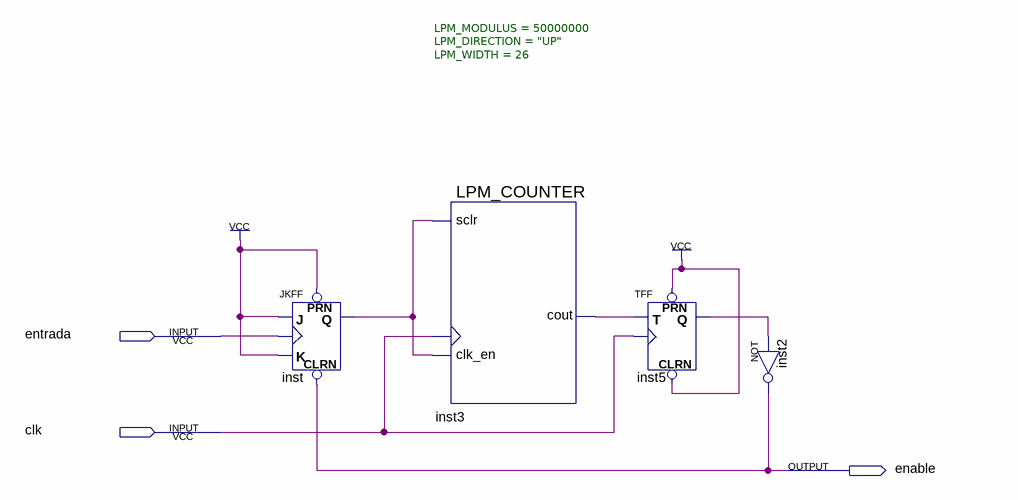
[diagram p0: schematic sheet]
// Quartus schematic pulse_to_buzzer.bdf as structural Verilog: 4 symbols, 3 pins
module pulse_to_buzzer (
  input  entrada,
  input  clk,
  output enable
);

  wire inst3_cout, inst5_q, inst_q;

  JKFF inst (.PRN(1'b1), .CLRN(enable), .K(1'b1), .J(1'b1), .CLK(entrada), .Q(inst_q));
  LPM_COUNTER #(.LPM_MODULUS(50000000), .LPM_DIRECTION("UP"), .LPM_WIDTH(26)) inst3 (
    .clk_en(inst_q), .clock(clk), .sclr(inst_q), .cout(inst3_cout));
  TFF inst5 (.PRN(1'b1), .CLRN(1'b1), .T(inst3_cout), .CLK(clk), .Q(inst5_q));
  not inst2 (enable, inst5_q);
endmodule
